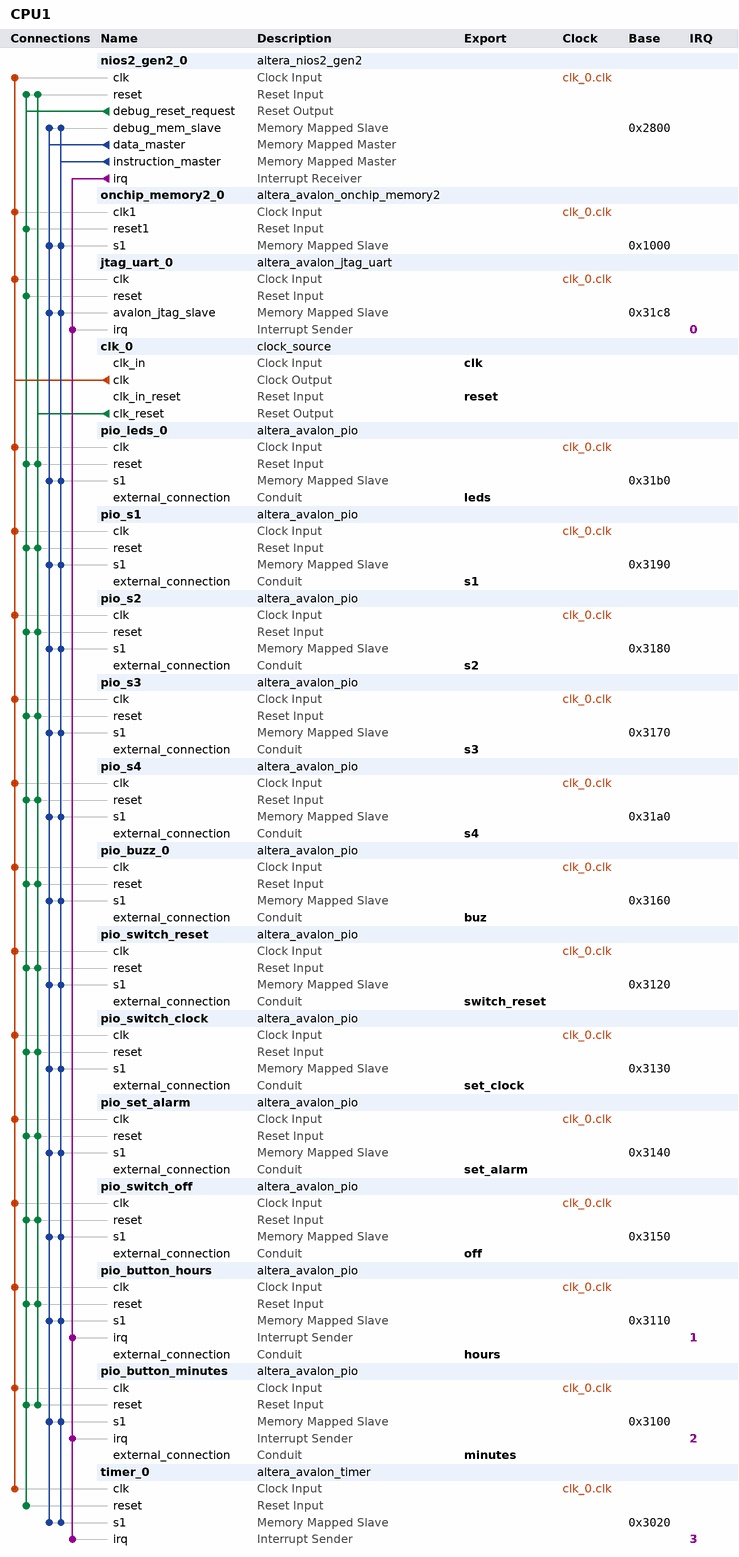
[diagram p0: system contents]
# Platform Designer (Qsys) system CPU1, Cyclone V 5CSEMA5F31C6
# Parameters at their usual value, and those the tool derives, are not listed.
package require -exact qsys 18.1
create_system CPU1
set_project_property DEVICE_FAMILY {Cyclone V}
set_project_property DEVICE 5CSEMA5F31C6

add_instance nios2_gen2_0 altera_nios2_gen2 18.1
set_instance_parameter_value nios2_gen2_0 dcache_size 2048
set_instance_parameter_value nios2_gen2_0 exceptionSlave onchip_memory2_0.s1
set_instance_parameter_value nios2_gen2_0 icache_size 4096
set_instance_parameter_value nios2_gen2_0 impl Tiny
set_instance_parameter_value nios2_gen2_0 resetSlave onchip_memory2_0.s1

add_instance onchip_memory2_0 altera_avalon_onchip_memory2 18.1
set_instance_parameter_value onchip_memory2_0 dataWidth 32
set_instance_parameter_value onchip_memory2_0 dualPort false
set_instance_parameter_value onchip_memory2_0 initMemContent true
set_instance_parameter_value onchip_memory2_0 initializationFileName onchip_mem.hex
set_instance_parameter_value onchip_memory2_0 memorySize 4096

add_instance jtag_uart_0 altera_avalon_jtag_uart 18.1
set_instance_parameter_value jtag_uart_0 simInteractiveOptions NO_INTERACTIVE_WINDOWS

add_instance clk_0 clock_source 18.1
set_instance_parameter_value clk_0 clockFrequency 50000000

add_instance pio_leds_0 altera_avalon_pio 18.1
set_instance_parameter_value pio_leds_0 direction Output
set_instance_parameter_value pio_leds_0 width 2

add_instance pio_s1 altera_avalon_pio 18.1
set_instance_parameter_value pio_s1 direction Output
set_instance_parameter_value pio_s1 width 7

add_instance pio_s2 altera_avalon_pio 18.1
set_instance_parameter_value pio_s2 direction Output
set_instance_parameter_value pio_s2 width 7

add_instance pio_s3 altera_avalon_pio 18.1
set_instance_parameter_value pio_s3 direction Output
set_instance_parameter_value pio_s3 width 7

add_instance pio_s4 altera_avalon_pio 18.1
set_instance_parameter_value pio_s4 direction Output
set_instance_parameter_value pio_s4 width 7

add_instance pio_buzz_0 altera_avalon_pio 18.1
set_instance_parameter_value pio_buzz_0 direction Output
set_instance_parameter_value pio_buzz_0 width 1

add_instance pio_switch_reset altera_avalon_pio 18.1
set_instance_parameter_value pio_switch_reset direction Input
set_instance_parameter_value pio_switch_reset width 1

add_instance pio_switch_clock altera_avalon_pio 18.1
set_instance_parameter_value pio_switch_clock direction Input
set_instance_parameter_value pio_switch_clock width 1

add_instance pio_set_alarm altera_avalon_pio 18.1
set_instance_parameter_value pio_set_alarm direction Input
set_instance_parameter_value pio_set_alarm width 1

add_instance pio_switch_off altera_avalon_pio 18.1
set_instance_parameter_value pio_switch_off direction Input
set_instance_parameter_value pio_switch_off width 1

add_instance pio_button_hours altera_avalon_pio 18.1
set_instance_parameter_value pio_button_hours captureEdge true
set_instance_parameter_value pio_button_hours direction Input
set_instance_parameter_value pio_button_hours generateIRQ true
set_instance_parameter_value pio_button_hours width 1

add_instance pio_button_minutes altera_avalon_pio 18.1
set_instance_parameter_value pio_button_minutes captureEdge true
set_instance_parameter_value pio_button_minutes direction Input
set_instance_parameter_value pio_button_minutes generateIRQ true
set_instance_parameter_value pio_button_minutes width 1

add_instance timer_0 altera_avalon_timer 18.1
set_instance_parameter_value timer_0 alwaysRun true
set_instance_parameter_value timer_0 fixedPeriod true
set_instance_parameter_value timer_0 period 1
set_instance_parameter_value timer_0 periodUnits SEC
set_instance_parameter_value timer_0 snapshot false

# connections
add_connection clk_0.clk jtag_uart_0.clk clock
add_connection clk_0.clk nios2_gen2_0.clk clock
add_connection clk_0.clk onchip_memory2_0.clk1 clock
add_connection clk_0.clk pio_button_hours.clk clock
add_connection clk_0.clk pio_button_minutes.clk clock
add_connection clk_0.clk pio_buzz_0.clk clock
add_connection clk_0.clk pio_leds_0.clk clock
add_connection clk_0.clk pio_s1.clk clock
add_connection clk_0.clk pio_s2.clk clock
add_connection clk_0.clk pio_s3.clk clock
add_connection clk_0.clk pio_s4.clk clock
add_connection clk_0.clk pio_set_alarm.clk clock
add_connection clk_0.clk pio_switch_clock.clk clock
add_connection clk_0.clk pio_switch_off.clk clock
add_connection clk_0.clk pio_switch_reset.clk clock
add_connection clk_0.clk timer_0.clk clock
add_connection clk_0.clk_reset nios2_gen2_0.reset reset
add_connection clk_0.clk_reset pio_button_hours.reset reset
add_connection clk_0.clk_reset pio_button_minutes.reset reset
add_connection clk_0.clk_reset pio_buzz_0.reset reset
add_connection clk_0.clk_reset pio_leds_0.reset reset
add_connection clk_0.clk_reset pio_s1.reset reset
add_connection clk_0.clk_reset pio_s2.reset reset
add_connection clk_0.clk_reset pio_s3.reset reset
add_connection clk_0.clk_reset pio_s4.reset reset
add_connection clk_0.clk_reset pio_set_alarm.reset reset
add_connection clk_0.clk_reset pio_switch_clock.reset reset
add_connection clk_0.clk_reset pio_switch_off.reset reset
add_connection clk_0.clk_reset pio_switch_reset.reset reset
add_connection nios2_gen2_0.debug_reset_request jtag_uart_0.reset reset
add_connection nios2_gen2_0.debug_reset_request nios2_gen2_0.reset reset
add_connection nios2_gen2_0.debug_reset_request onchip_memory2_0.reset1 reset
add_connection nios2_gen2_0.debug_reset_request pio_button_hours.reset reset
add_connection nios2_gen2_0.debug_reset_request pio_button_minutes.reset reset
add_connection nios2_gen2_0.debug_reset_request pio_buzz_0.reset reset
add_connection nios2_gen2_0.debug_reset_request pio_leds_0.reset reset
add_connection nios2_gen2_0.debug_reset_request pio_s1.reset reset
add_connection nios2_gen2_0.debug_reset_request pio_s2.reset reset
add_connection nios2_gen2_0.debug_reset_request pio_s3.reset reset
add_connection nios2_gen2_0.debug_reset_request pio_s4.reset reset
add_connection nios2_gen2_0.debug_reset_request pio_set_alarm.reset reset
add_connection nios2_gen2_0.debug_reset_request pio_switch_clock.reset reset
add_connection nios2_gen2_0.debug_reset_request pio_switch_off.reset reset
add_connection nios2_gen2_0.debug_reset_request pio_switch_reset.reset reset
add_connection nios2_gen2_0.debug_reset_request timer_0.reset reset
add_connection nios2_gen2_0.data_master jtag_uart_0.avalon_jtag_slave avalon
set_connection_parameter_value nios2_gen2_0.data_master/jtag_uart_0.avalon_jtag_slave baseAddress 0x31c8
add_connection nios2_gen2_0.data_master nios2_gen2_0.debug_mem_slave avalon
set_connection_parameter_value nios2_gen2_0.data_master/nios2_gen2_0.debug_mem_slave baseAddress 0x2800
add_connection nios2_gen2_0.data_master onchip_memory2_0.s1 avalon
set_connection_parameter_value nios2_gen2_0.data_master/onchip_memory2_0.s1 baseAddress 0x1000
add_connection nios2_gen2_0.data_master pio_button_hours.s1 avalon
set_connection_parameter_value nios2_gen2_0.data_master/pio_button_hours.s1 baseAddress 0x3110
add_connection nios2_gen2_0.data_master pio_button_minutes.s1 avalon
set_connection_parameter_value nios2_gen2_0.data_master/pio_button_minutes.s1 baseAddress 0x3100
add_connection nios2_gen2_0.data_master pio_buzz_0.s1 avalon
set_connection_parameter_value nios2_gen2_0.data_master/pio_buzz_0.s1 baseAddress 0x3160
add_connection nios2_gen2_0.data_master pio_leds_0.s1 avalon
set_connection_parameter_value nios2_gen2_0.data_master/pio_leds_0.s1 baseAddress 0x31b0
add_connection nios2_gen2_0.data_master pio_s1.s1 avalon
set_connection_parameter_value nios2_gen2_0.data_master/pio_s1.s1 baseAddress 0x3190
add_connection nios2_gen2_0.data_master pio_s2.s1 avalon
set_connection_parameter_value nios2_gen2_0.data_master/pio_s2.s1 baseAddress 0x3180
add_connection nios2_gen2_0.data_master pio_s3.s1 avalon
set_connection_parameter_value nios2_gen2_0.data_master/pio_s3.s1 baseAddress 0x3170
add_connection nios2_gen2_0.data_master pio_s4.s1 avalon
set_connection_parameter_value nios2_gen2_0.data_master/pio_s4.s1 baseAddress 0x31a0
add_connection nios2_gen2_0.data_master pio_set_alarm.s1 avalon
set_connection_parameter_value nios2_gen2_0.data_master/pio_set_alarm.s1 baseAddress 0x3140
add_connection nios2_gen2_0.data_master pio_switch_clock.s1 avalon
set_connection_parameter_value nios2_gen2_0.data_master/pio_switch_clock.s1 baseAddress 0x3130
add_connection nios2_gen2_0.data_master pio_switch_off.s1 avalon
set_connection_parameter_value nios2_gen2_0.data_master/pio_switch_off.s1 baseAddress 0x3150
add_connection nios2_gen2_0.data_master pio_switch_reset.s1 avalon
set_connection_parameter_value nios2_gen2_0.data_master/pio_switch_reset.s1 baseAddress 0x3120
add_connection nios2_gen2_0.data_master timer_0.s1 avalon
set_connection_parameter_value nios2_gen2_0.data_master/timer_0.s1 baseAddress 0x3020
add_connection nios2_gen2_0.instruction_master jtag_uart_0.avalon_jtag_slave avalon
set_connection_parameter_value nios2_gen2_0.instruction_master/jtag_uart_0.avalon_jtag_slave baseAddress 0x31c8
add_connection nios2_gen2_0.instruction_master nios2_gen2_0.debug_mem_slave avalon
set_connection_parameter_value nios2_gen2_0.instruction_master/nios2_gen2_0.debug_mem_slave baseAddress 0x2800
add_connection nios2_gen2_0.instruction_master onchip_memory2_0.s1 avalon
set_connection_parameter_value nios2_gen2_0.instruction_master/onchip_memory2_0.s1 baseAddress 0x1000
add_connection nios2_gen2_0.instruction_master pio_button_hours.s1 avalon
set_connection_parameter_value nios2_gen2_0.instruction_master/pio_button_hours.s1 baseAddress 0x3110
add_connection nios2_gen2_0.instruction_master pio_button_minutes.s1 avalon
set_connection_parameter_value nios2_gen2_0.instruction_master/pio_button_minutes.s1 baseAddress 0x3100
add_connection nios2_gen2_0.instruction_master pio_buzz_0.s1 avalon
set_connection_parameter_value nios2_gen2_0.instruction_master/pio_buzz_0.s1 baseAddress 0x3160
add_connection nios2_gen2_0.instruction_master pio_leds_0.s1 avalon
set_connection_parameter_value nios2_gen2_0.instruction_master/pio_leds_0.s1 baseAddress 0x31b0
add_connection nios2_gen2_0.instruction_master pio_s1.s1 avalon
set_connection_parameter_value nios2_gen2_0.instruction_master/pio_s1.s1 baseAddress 0x3190
add_connection nios2_gen2_0.instruction_master pio_s2.s1 avalon
set_connection_parameter_value nios2_gen2_0.instruction_master/pio_s2.s1 baseAddress 0x3180
add_connection nios2_gen2_0.instruction_master pio_s3.s1 avalon
set_connection_parameter_value nios2_gen2_0.instruction_master/pio_s3.s1 baseAddress 0x3170
add_connection nios2_gen2_0.instruction_master pio_s4.s1 avalon
set_connection_parameter_value nios2_gen2_0.instruction_master/pio_s4.s1 baseAddress 0x31a0
add_connection nios2_gen2_0.instruction_master pio_set_alarm.s1 avalon
set_connection_parameter_value nios2_gen2_0.instruction_master/pio_set_alarm.s1 baseAddress 0x3140
add_connection nios2_gen2_0.instruction_master pio_switch_clock.s1 avalon
set_connection_parameter_value nios2_gen2_0.instruction_master/pio_switch_clock.s1 baseAddress 0x3130
add_connection nios2_gen2_0.instruction_master pio_switch_off.s1 avalon
set_connection_parameter_value nios2_gen2_0.instruction_master/pio_switch_off.s1 baseAddress 0x3150
add_connection nios2_gen2_0.instruction_master pio_switch_reset.s1 avalon
set_connection_parameter_value nios2_gen2_0.instruction_master/pio_switch_reset.s1 baseAddress 0x3120
add_connection nios2_gen2_0.instruction_master timer_0.s1 avalon
set_connection_parameter_value nios2_gen2_0.instruction_master/timer_0.s1 baseAddress 0x3020
add_connection nios2_gen2_0.irq jtag_uart_0.irq interrupt
set_connection_parameter_value nios2_gen2_0.irq/jtag_uart_0.irq irqNumber 0
add_connection nios2_gen2_0.irq pio_button_hours.irq interrupt
set_connection_parameter_value nios2_gen2_0.irq/pio_button_hours.irq irqNumber 1
add_connection nios2_gen2_0.irq pio_button_minutes.irq interrupt
set_connection_parameter_value nios2_gen2_0.irq/pio_button_minutes.irq irqNumber 2
add_connection nios2_gen2_0.irq timer_0.irq interrupt
set_connection_parameter_value nios2_gen2_0.irq/timer_0.irq irqNumber 3

# exported interfaces
add_interface buz conduit end
set_interface_property buz EXPORT_OF pio_buzz_0.external_connection
add_interface clk clock sink
set_interface_property clk EXPORT_OF clk_0.clk_in
add_interface hours conduit end
set_interface_property hours EXPORT_OF pio_button_hours.external_connection
add_interface leds conduit end
set_interface_property leds EXPORT_OF pio_leds_0.external_connection
add_interface minutes conduit end
set_interface_property minutes EXPORT_OF pio_button_minutes.external_connection
add_interface off conduit end
set_interface_property off EXPORT_OF pio_switch_off.external_connection
add_interface reset reset sink
set_interface_property reset EXPORT_OF clk_0.clk_in_reset
add_interface s1 conduit end
set_interface_property s1 EXPORT_OF pio_s1.external_connection
add_interface s2 conduit end
set_interface_property s2 EXPORT_OF pio_s2.external_connection
add_interface s3 conduit end
set_interface_property s3 EXPORT_OF pio_s3.external_connection
add_interface s4 conduit end
set_interface_property s4 EXPORT_OF pio_s4.external_connection
add_interface set_alarm conduit end
set_interface_property set_alarm EXPORT_OF pio_set_alarm.external_connection
add_interface set_clock conduit end
set_interface_property set_clock EXPORT_OF pio_switch_clock.external_connection
add_interface switch_reset conduit end
set_interface_property switch_reset EXPORT_OF pio_switch_reset.external_connection

set_interconnect_requirement {$system} qsys_mm.clockCrossingAdapter HANDSHAKE
set_interconnect_requirement {$system} qsys_mm.enableEccProtection FALSE
set_interconnect_requirement {$system} qsys_mm.insertDefaultSlave FALSE
set_interconnect_requirement {$system} qsys_mm.maxAdditionalLatency 1

save_system CPU1.qsys
